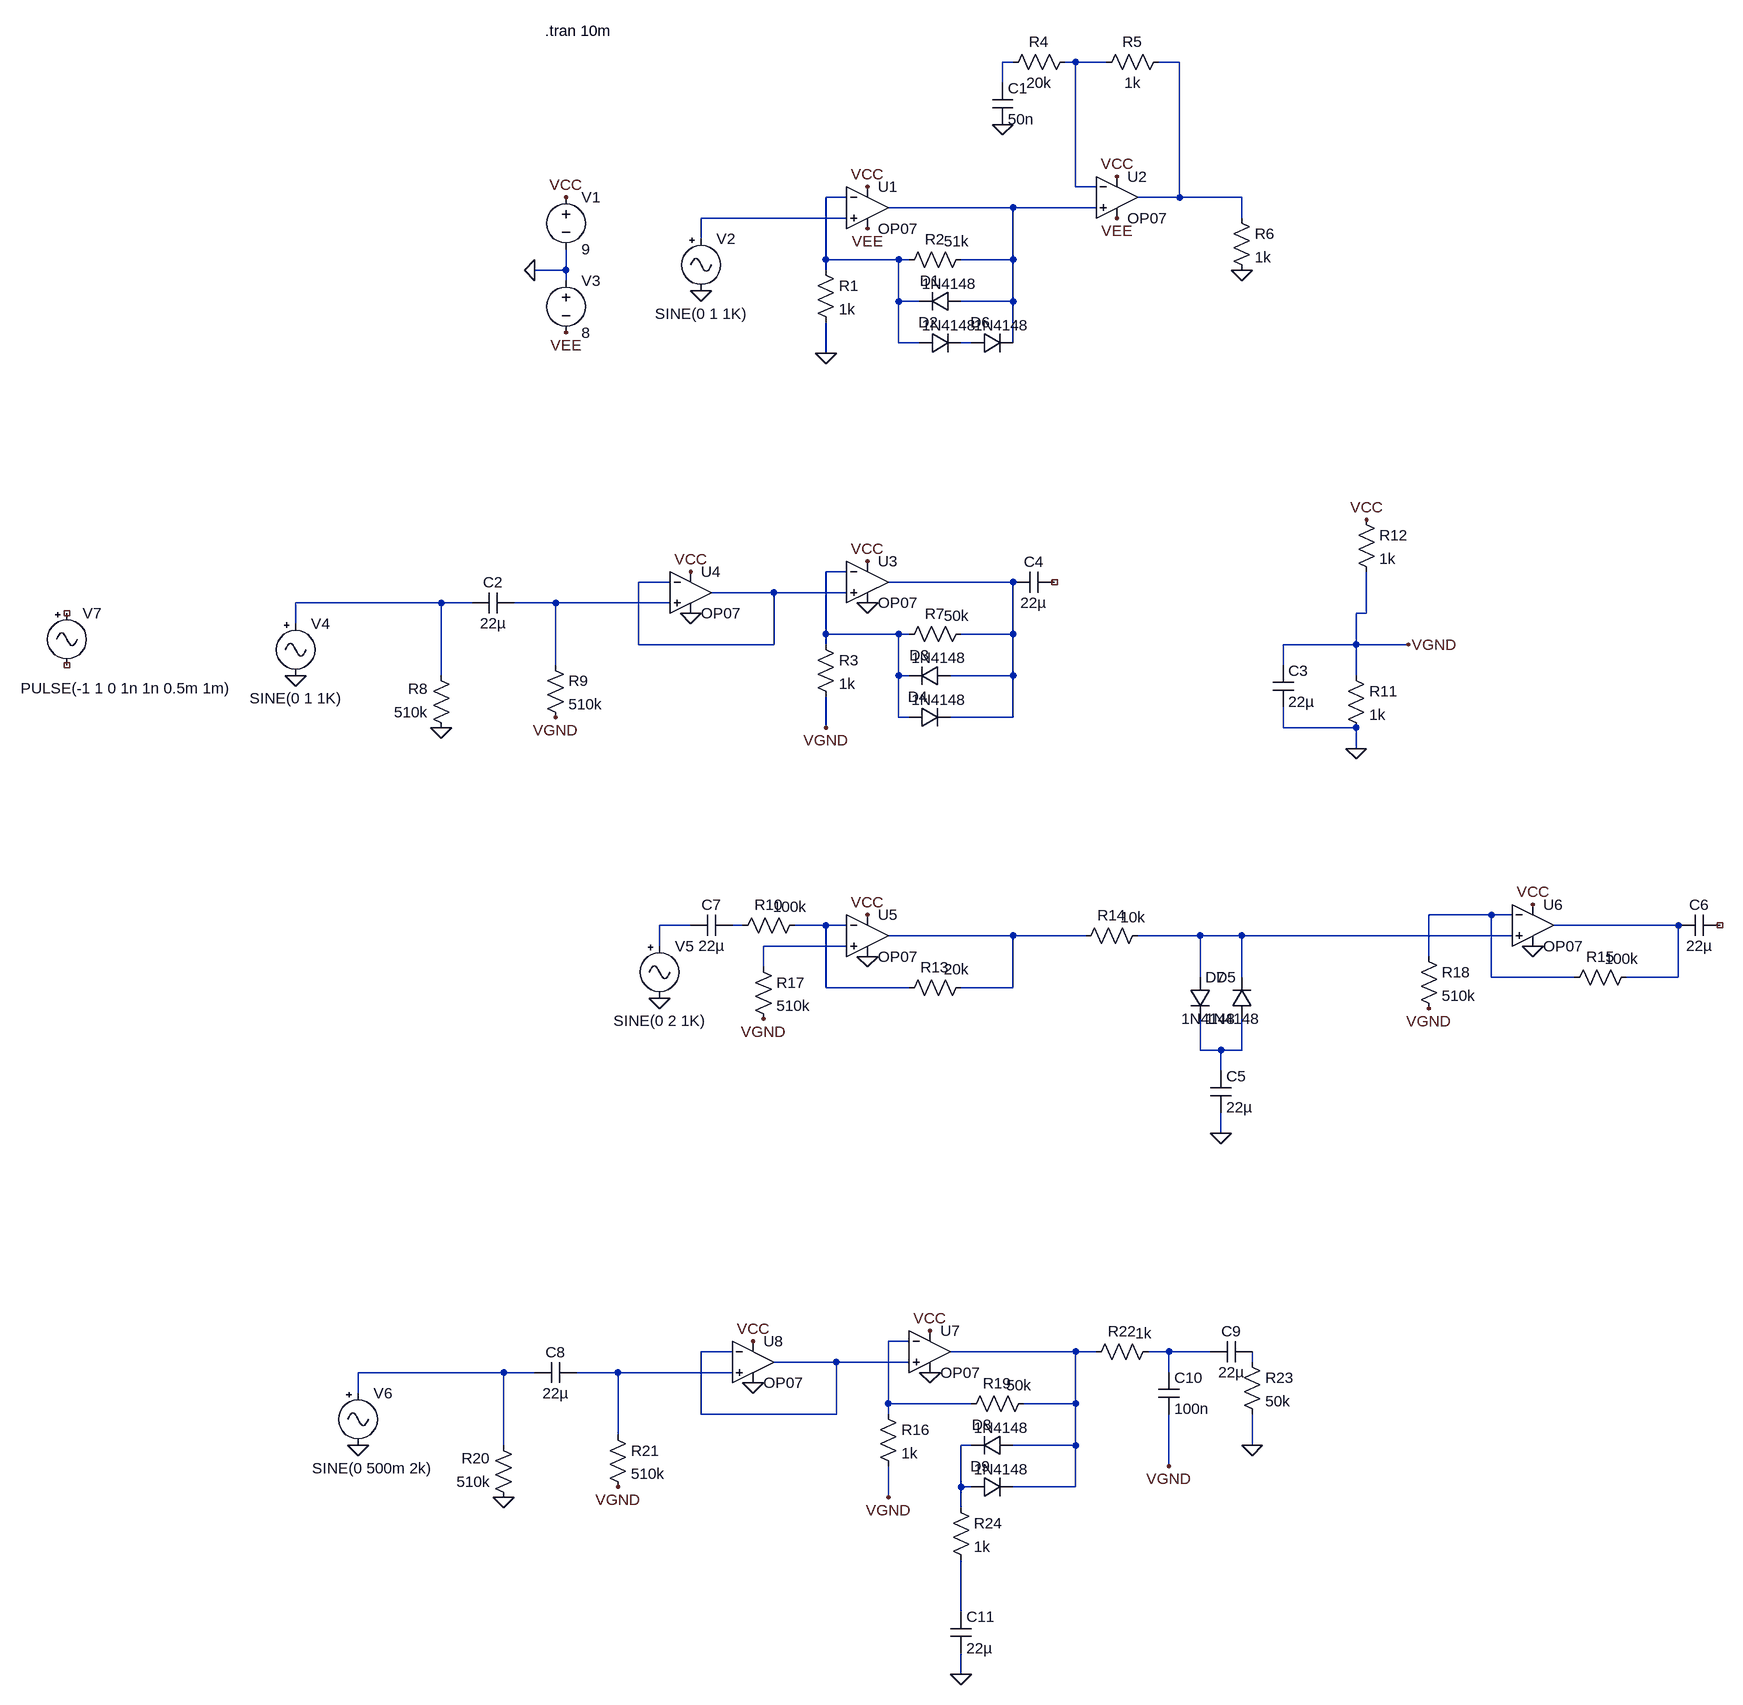
[diagram p0: schematic fuzz.asc]
fuzz.asc, the LTspice schematic file:
Version 4
SHEET 1 1528 2416
WIRE 432 -80 416 -80
WIRE 528 -80 512 -80
WIRE 576 -80 528 -80
WIRE 688 -80 656 -80
WIRE 416 -48 416 -80
WIRE 528 112 528 -80
WIRE 560 112 528 112
WIRE 176 128 144 128
WIRE 688 128 688 -80
WIRE 688 128 624 128
WIRE 784 128 688 128
WIRE 432 144 240 144
WIRE 560 144 432 144
WIRE 176 160 -48 160
WIRE 784 160 784 128
WIRE -48 192 -48 160
WIRE 144 224 144 128
WIRE 256 224 144 224
WIRE 272 224 256 224
WIRE 432 224 432 144
WIRE 432 224 352 224
WIRE -256 240 -256 208
WIRE -256 240 -304 240
WIRE 144 240 144 224
WIRE -256 256 -256 240
WIRE 256 288 256 224
WIRE 288 288 256 288
WIRE 432 288 432 224
WIRE 432 288 352 288
WIRE 256 352 256 288
WIRE 288 352 256 352
WIRE 368 352 352 352
WIRE 432 352 432 288
WIRE 144 368 144 320
WIRE 176 704 144 704
WIRE -96 720 -144 720
WIRE 432 720 240 720
WIRE 64 736 -32 736
WIRE 176 736 64 736
WIRE -448 752 -672 752
WIRE -400 752 -448 752
WIRE -272 752 -336 752
WIRE -96 752 -272 752
WIRE 976 768 976 704
WIRE 976 768 960 768
WIRE -672 784 -672 752
WIRE 144 800 144 704
WIRE 256 800 144 800
WIRE 272 800 256 800
WIRE 432 800 432 720
WIRE 432 800 352 800
WIRE -144 816 -144 720
WIRE 64 816 64 736
WIRE 64 816 -144 816
WIRE 144 816 144 800
WIRE 960 816 960 768
WIRE 960 816 848 816
WIRE 1040 816 960 816
WIRE -272 848 -272 752
WIRE 848 848 848 816
WIRE -448 864 -448 752
WIRE 256 864 256 800
WIRE 272 864 256 864
WIRE 432 864 432 800
WIRE 432 864 336 864
WIRE 960 864 960 816
WIRE 256 928 256 864
WIRE 272 928 256 928
WIRE 432 928 432 864
WIRE 432 928 336 928
WIRE 144 944 144 896
WIRE 848 944 848 912
WIRE 960 944 848 944
WIRE 960 976 960 944
WIRE 1168 1232 1072 1232
WIRE 1200 1232 1168 1232
WIRE -64 1248 -112 1248
WIRE 16 1248 0 1248
WIRE 144 1248 96 1248
WIRE 176 1248 144 1248
WIRE 1456 1248 1264 1248
WIRE 432 1264 240 1264
WIRE 544 1264 432 1264
WIRE 720 1264 624 1264
WIRE 784 1264 720 1264
WIRE 1200 1264 784 1264
WIRE -112 1280 -112 1248
WIRE 176 1280 48 1280
WIRE 1072 1296 1072 1232
WIRE 48 1312 48 1280
WIRE 720 1328 720 1264
WIRE 784 1328 784 1264
WIRE 1168 1328 1168 1232
WIRE 1296 1328 1168 1328
WIRE 1456 1328 1456 1248
WIRE 1456 1328 1376 1328
WIRE 144 1344 144 1248
WIRE 272 1344 144 1344
WIRE 432 1344 432 1264
WIRE 432 1344 352 1344
WIRE 720 1440 720 1392
WIRE 752 1440 720 1440
WIRE 784 1440 784 1392
WIRE 784 1440 752 1440
WIRE 752 1472 752 1440
WIRE 752 1568 752 1536
WIRE 272 1888 240 1888
WIRE 0 1904 -48 1904
WIRE 528 1904 336 1904
WIRE 560 1904 528 1904
WIRE 672 1904 640 1904
WIRE 736 1904 672 1904
WIRE 160 1920 64 1920
WIRE 272 1920 160 1920
WIRE 800 1920 800 1904
WIRE -352 1936 -576 1936
WIRE -304 1936 -352 1936
WIRE -176 1936 -240 1936
WIRE 0 1936 -176 1936
WIRE 672 1936 672 1904
WIRE -576 1968 -576 1936
WIRE 240 1984 240 1888
WIRE 368 1984 240 1984
WIRE 528 1984 528 1904
WIRE 528 1984 448 1984
WIRE -48 2000 -48 1904
WIRE 160 2000 160 1920
WIRE 160 2000 -48 2000
WIRE 240 2000 240 1984
WIRE -176 2032 -176 1936
WIRE -352 2048 -352 1936
WIRE 368 2048 352 2048
WIRE 528 2048 528 1984
WIRE 528 2048 432 2048
WIRE 800 2048 800 2000
WIRE 672 2080 672 2000
WIRE 352 2112 352 2048
WIRE 368 2112 352 2112
WIRE 528 2112 528 2048
WIRE 528 2112 432 2112
WIRE 240 2128 240 2080
WIRE 352 2144 352 2112
WIRE 352 2304 352 2224
WIRE 352 2400 352 2368
FLAG -256 128 VCC
FLAG -304 240 0
FLAG 144 368 0
FLAG 208 112 VCC
FLAG -48 272 0
FLAG -256 336 VEE
FLAG 208 176 VEE
FLAG 592 96 VCC
FLAG 592 160 VEE
FLAG 416 16 0
FLAG 784 240 0
FLAG 144 944 VGND
FLAG 208 688 VCC
FLAG 208 752 0
FLAG -448 944 0
FLAG -64 704 VCC
FLAG -64 768 0
FLAG -672 864 0
FLAG 976 624 VCC
FLAG 960 976 0
FLAG 1040 816 VGND
FLAG -272 928 VGND
FLAG 208 1232 VCC
FLAG 208 1296 0
FLAG -112 1360 0
FLAG 48 1392 VGND
FLAG 752 1568 0
FLAG 1232 1216 VCC
FLAG 1232 1280 0
FLAG 1072 1376 VGND
FLAG 240 2128 VGND
FLAG 304 1872 VCC
FLAG 304 1936 0
FLAG -352 2128 0
FLAG 32 1888 VCC
FLAG 32 1952 0
FLAG -576 2048 0
FLAG -176 2112 VGND
FLAG 672 2080 VGND
FLAG 800 2048 0
FLAG 352 2400 0
SYMBOL OpAmps/OP07 208 80 R0
SYMATTR InstName U1
SYMBOL res 128 224 R0
SYMATTR InstName R1
SYMATTR Value 1k
SYMBOL res 368 208 R90
WINDOW 0 0 56 VBottom 2
WINDOW 3 -28 23 VTop 2
SYMATTR InstName R2
SYMATTR Value 51k
SYMBOL diode 352 272 R90
WINDOW 0 0 48 VBottom 2
WINDOW 3 -27 18 VTop 2
SYMATTR InstName D1
SYMATTR Value 1N4148
SYMBOL diode 288 368 R270
WINDOW 0 32 14 VTop 2
WINDOW 3 59 46 VBottom 2
SYMATTR InstName D2
SYMATTR Value 1N4148
SYMBOL voltage -256 112 R0
SYMATTR InstName V1
SYMATTR Value 9
SYMBOL Misc/signal -48 176 R0
WINDOW 3 -71 131 Left 2
SYMATTR InstName V2
SYMBOL voltage -256 240 R0
SYMATTR InstName V3
SYMATTR Value 8
SYMBOL OpAmps/OP07 592 64 R0
SYMATTR InstName U2
SYMBOL res 528 -96 R90
WINDOW 0 0 56 VBottom 2
WINDOW 3 32 56 VTop 2
SYMATTR InstName R4
SYMATTR Value 20k
SYMBOL res 672 -96 R90
WINDOW 0 0 56 VBottom 2
WINDOW 3 32 56 VTop 2
SYMATTR InstName R5
SYMATTR Value 1k
SYMBOL cap 400 -48 R0
SYMATTR InstName C1
SYMATTR Value 50n
SYMBOL res 768 144 R0
SYMATTR InstName R6
SYMATTR Value 1k
SYMBOL OpAmps/OP07 208 656 R0
SYMATTR InstName U3
SYMBOL res 128 800 R0
SYMATTR InstName R3
SYMATTR Value 1k
SYMBOL res 368 784 R90
WINDOW 0 0 56 VBottom 2
WINDOW 3 -28 23 VTop 2
SYMATTR InstName R7
SYMATTR Value 50k
SYMBOL diode 336 848 R90
WINDOW 0 0 48 VBottom 2
WINDOW 3 -27 18 VTop 2
SYMATTR InstName D3
SYMATTR Value 1N4148
SYMBOL diode 272 944 R270
WINDOW 0 32 14 VTop 2
WINDOW 3 59 46 VBottom 2
SYMATTR InstName D4
SYMATTR Value 1N4148
SYMBOL res -432 960 R180
WINDOW 0 36 76 Left 2
WINDOW 3 36 40 Left 2
SYMATTR InstName R8
SYMATTR Value 510k
SYMBOL cap -336 736 R90
WINDOW 0 0 32 VBottom 2
WINDOW 3 32 32 VTop 2
SYMATTR InstName C2
SYMATTR Value 22µ
SYMBOL res -288 832 R0
SYMATTR InstName R9
SYMATTR Value 510k
SYMBOL OpAmps/OP07 -64 672 R0
SYMATTR InstName U4
SYMBOL Misc/signal -672 768 R0
WINDOW 3 -71 131 Left 2
SYMATTR InstName V4
SYMBOL res 944 848 R0
SYMATTR InstName R11
SYMATTR Value 1k
SYMBOL res 960 608 R0
SYMATTR InstName R12
SYMATTR Value 1k
SYMBOL cap 832 848 R0
SYMATTR InstName C3
SYMATTR Value 22µ
SYMBOL diode 368 368 R270
WINDOW 0 32 14 VTop 2
WINDOW 3 59 46 VBottom 2
SYMATTR InstName D6
SYMATTR Value 1N4148
SYMBOL cap 432 736 R270
WINDOW 0 32 32 VTop 2
WINDOW 3 0 32 VBottom 2
SYMATTR InstName C4
SYMATTR Value 22µ
SYMBOL OpAmps/OP07 208 1200 R0
SYMATTR InstName U5
SYMBOL res 368 1328 R90
WINDOW 0 0 56 VBottom 2
WINDOW 3 -28 23 VTop 2
SYMATTR InstName R13
SYMATTR Value 20k
SYMBOL diode 800 1392 R180
WINDOW 0 24 64 Left 2
WINDOW 3 24 0 Left 2
SYMATTR InstName D5
SYMATTR Value 1N4148
SYMBOL diode 704 1328 R0
SYMATTR InstName D7
SYMATTR Value 1N4148
SYMBOL res 640 1248 R90
WINDOW 0 0 56 VBottom 2
WINDOW 3 -28 23 VTop 2
SYMATTR InstName R14
SYMATTR Value 10k
SYMBOL Misc/signal -112 1264 R0
WINDOW 3 -71 131 Left 2
SYMATTR Value SINE(0 2 1K)
SYMATTR InstName V5
SYMBOL res 112 1232 R90
WINDOW 0 0 56 VBottom 2
WINDOW 3 -28 23 VTop 2
SYMATTR InstName R10
SYMATTR Value 100k
SYMBOL res 32 1296 R0
SYMATTR InstName R17
SYMATTR Value 510k
SYMBOL cap 0 1232 R90
WINDOW 0 0 32 VBottom 2
WINDOW 3 32 32 VTop 2
SYMATTR InstName C7
SYMATTR Value 22µ
SYMBOL cap 736 1472 R0
SYMATTR InstName C5
SYMATTR Value 22µ
SYMBOL OpAmps/OP07 1232 1184 R0
SYMATTR InstName U6
SYMBOL res 1392 1312 R90
WINDOW 0 0 56 VBottom 2
WINDOW 3 -28 23 VTop 2
SYMATTR InstName R15
SYMATTR Value 100k
SYMBOL res 1056 1280 R0
SYMATTR InstName R18
SYMATTR Value 510k
SYMBOL cap 1456 1264 R270
WINDOW 0 32 32 VTop 2
WINDOW 3 0 32 VBottom 2
SYMATTR InstName C6
SYMATTR Value 22µ
SYMBOL OpAmps/OP07 304 1840 R0
SYMATTR InstName U7
SYMBOL res 224 1984 R0
SYMATTR InstName R16
SYMATTR Value 1k
SYMBOL res 464 1968 R90
WINDOW 0 0 56 VBottom 2
WINDOW 3 -28 23 VTop 2
SYMATTR InstName R19
SYMATTR Value 50k
SYMBOL diode 432 2032 R90
WINDOW 0 0 48 VBottom 2
WINDOW 3 -27 18 VTop 2
SYMATTR InstName D8
SYMATTR Value 1N4148
SYMBOL diode 368 2128 R270
WINDOW 0 32 14 VTop 2
WINDOW 3 59 46 VBottom 2
SYMATTR InstName D9
SYMATTR Value 1N4148
SYMBOL res -336 2144 R180
WINDOW 0 36 76 Left 2
WINDOW 3 36 40 Left 2
SYMATTR InstName R20
SYMATTR Value 510k
SYMBOL cap -240 1920 R90
WINDOW 0 0 32 VBottom 2
WINDOW 3 32 32 VTop 2
SYMATTR InstName C8
SYMATTR Value 22µ
SYMBOL res -192 2016 R0
SYMATTR InstName R21
SYMATTR Value 510k
SYMBOL OpAmps/OP07 32 1856 R0
SYMATTR InstName U8
SYMBOL Misc/signal -576 1952 R0
WINDOW 3 -71 131 Left 2
SYMATTR Value SINE(0 500m 2k)
SYMATTR InstName V6
SYMBOL cap 736 1920 R270
WINDOW 0 32 32 VTop 2
WINDOW 3 0 32 VBottom 2
SYMATTR InstName C9
SYMATTR Value 22µ
SYMBOL cap 656 1936 R0
SYMATTR InstName C10
SYMATTR Value 100n
SYMBOL res 656 1888 R90
WINDOW 0 0 56 VBottom 2
WINDOW 3 -28 23 VTop 2
SYMATTR InstName R22
SYMATTR Value 1k
SYMBOL res 784 1904 R0
SYMATTR InstName R23
SYMATTR Value 50k
SYMBOL cap 336 2304 R0
SYMATTR InstName C11
SYMATTR Value 22µ
SYMBOL res 336 2128 R0
SYMATTR InstName R24
SYMATTR Value 1k
SYMBOL Misc/signal -1024 752 R0
WINDOW 3 -71 131 Left 2
SYMATTR Value PULSE(-1 1 0 1n 1n 0.5m 1m)
SYMATTR InstName V7
TEXT -288 -128 Left 2 !.tran 10m

The netlist it stands for:
* fuzz.asc
XU1 N006 N004 VCC VEE N005 LT1001  ; OP07, pins In+ In- V+ V- OUT
R1 N004 0 1k
R2 N005 N004 51k
D1 N005 N004 1N4148
D2 N004 N007 1N4148
V1 VCC 0 9
V2 N006 0 SINE(0 1 1K)
V3 0 VEE 8
XU2 N005 N002 VCC VEE N003 LT1001  ; OP07, pins In+ In- V+ V- OUT
R4 N002 N001 20k
R5 N003 N002 1k
C1 N001 0 50n
R6 N003 0 1k
XU3 N009 N008 VCC 0 N010 LT1001  ; OP07, pins In+ In- V+ V- OUT
R3 N008 VGND 1k
R7 N010 N008 50k
D3 N010 N008 1N4148
D4 N008 N010 1N4148
R8 0 N011 510k
C2 N012 N011 22µ
R9 N012 VGND 510k
XU4 N012 N009 VCC 0 N009 LT1001  ; OP07, pins In+ In- V+ V- OUT
V4 N011 0 SINE(0 1 1K)
R11 VGND 0 1k
R12 VCC VGND 1k
C3 VGND 0 22µ
D6 N007 N005 1N4148
C4 N010 NC_01 22µ
XU5 N020 N016 VCC 0 N018 LT1001  ; OP07, pins In+ In- V+ V- OUT
R13 N018 N016 20k
D5 N021 N019 1N4148
D7 N019 N021 1N4148
R14 N019 N018 10k
V5 N014 0 SINE(0 2 1K)
R10 N016 N015 100k
R17 N020 VGND 510k
C7 N015 N014 22µ
C5 N021 0 22µ
XU6 N019 N013 VCC 0 N017 LT1001  ; OP07, pins In+ In- V+ V- OUT
R15 N017 N013 100k
R18 N013 VGND 510k
C6 N017 NC_02 22µ
XU7 N023 N022 VCC 0 N024 LT1001  ; OP07, pins In+ In- V+ V- OUT
R16 N022 VGND 1k
R19 N024 N022 50k
D8 N024 N029 1N4148
D9 N029 N024 1N4148
R20 0 N027 510k
C8 N028 N027 22µ
R21 N028 VGND 510k
XU8 N028 N023 VCC 0 N023 LT1001  ; OP07, pins In+ In- V+ V- OUT
V6 N027 0 SINE(0 500m 2k)
C9 N025 N026 22µ
C10 N025 VGND 100n
R22 N025 N024 1k
R23 N026 0 50k
C11 N030 0 22µ
R24 N029 N030 1k
V7 NC_03 NC_04 PULSE(-1 1 0 1n 1n 0.5m 1m)
.model D D
.lib standard.dio
.tran 10m
.lib LTC.lib
.backanno
.end